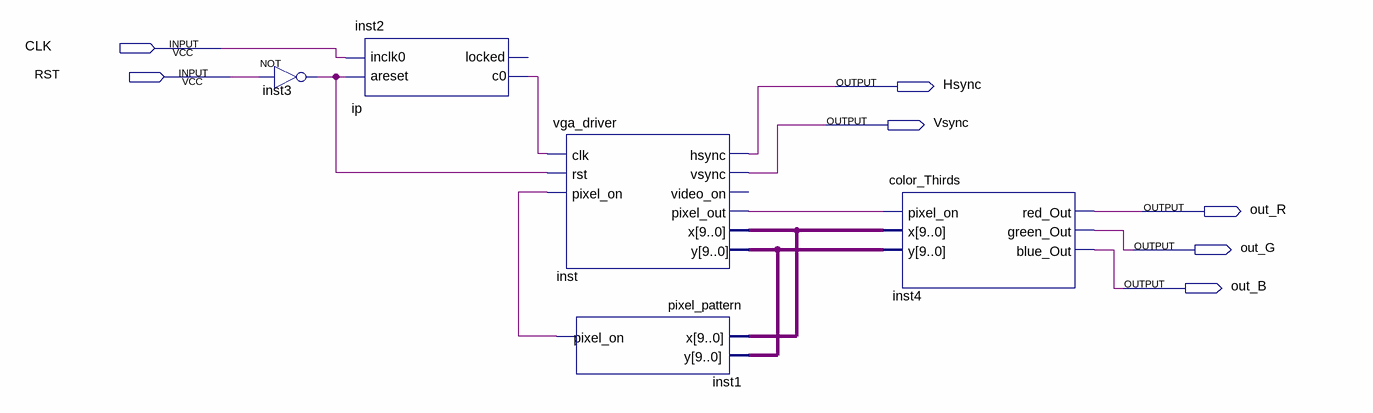
[diagram p0: schematic sheet]
// Quartus schematic VGASystem.bdf as structural Verilog: 5 symbols, 7 pins
module VGASystem (
  input  CLK,
  input  RST,
  output Hsync,
  output Vsync,
  output out_R,
  output out_G,
  output out_B
);

  wire inst1_pixel_on, inst2_c0, inst3_out, inst_pixel_out;
  wire [9:0] inst_x, inst_y;

  not inst3 (inst3_out, RST);
  ip inst2 (.areset(inst3_out), .inclk0(CLK), .c0(inst2_c0));  // open: locked
  vga_driver inst (
    .clk(inst2_c0), .rst(inst3_out), .pixel_on(inst1_pixel_on), .hsync(Hsync), .vsync(Vsync),
    .pixel_out(inst_pixel_out), .x(inst_x), .y(inst_y));  // open: video_on
  pixel_pattern inst1 (.x(inst_x), .y(inst_y), .pixel_on(inst1_pixel_on));
  color_Thirds inst4 (
    .pixel_on(inst_pixel_out), .x(inst_x), .y(inst_y), .red_Out(out_R), .green_Out(out_G), .blue_Out(out_B));
endmodule
